# Altium schematic sheet Power Supply.SchDoc
size A3; SheetNumber: 3; SheetTotal: 3
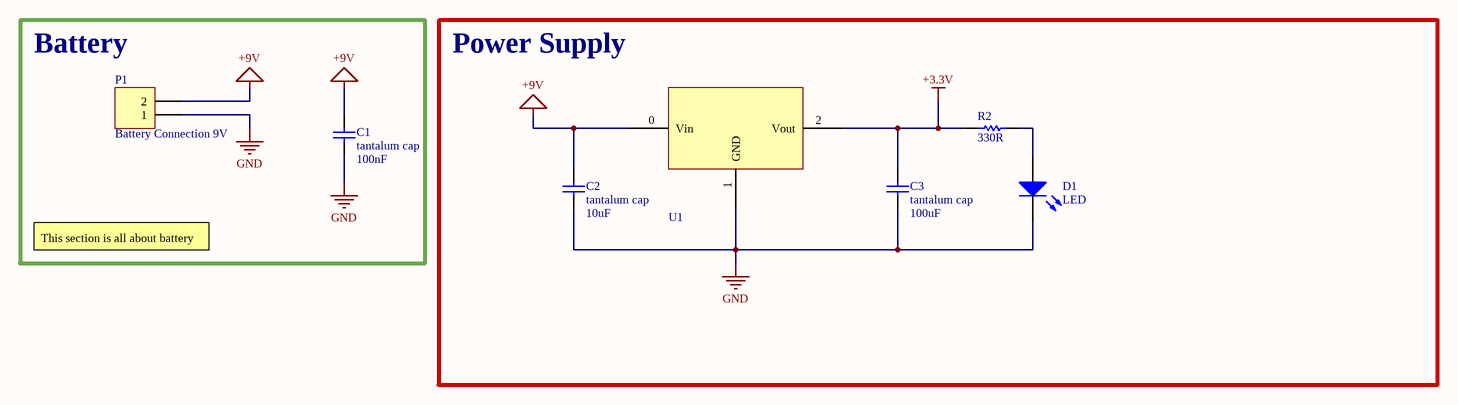
[diagram p0: Power Supply.SchDoc]

## Parts
C1  tantalum cap  value 100nF  [C1206tancap]
C2  tantalum cap  value 10uF  [C1206tancap]
C3  tantalum cap  value 100uF  [C1206tancap]
D1  LED  [MY_LED_0805]
P1  Battery Connection 9V  [HDR1X2H3dbody]
R2  330R  [MY_0805]
U1  LM1117  [LM1117]  (value not drawn)

## Blocks framed on the sheet
Battery: C1 P1
Power Supply: C2 C3 D1 R2 U1

## Nets
+3.3V: C3.2 R2.1 U1.2(Vout)
+9V: C1.2 C2.2 P1.2 U1.0(Vin)
GND: C1.1 C2.1 C3.1 D1.K P1.1 U1.1(GND)
NetD1_A: D1.A R2.2

## Notes on the sheet
- This section is all about battery

## Library data of the parts
C1-C3 = Cap Semi_6: Capacitor (Semiconductor SIM Model); Published: 8-Jun-2000; LatestRevisionDate: 29-May-2009; LatestRevisionNote: IPC-7351 Footprint Added.; PackageReference: C1206; Publisher: Altium Limited; PackageDescription: Chip Capacitor
D1 = LED: Typical INFRARED GaAs LED; ASiD Part Number: LED-AS
P1 = Header 2H: Header, 2-Pin, Right Angle; LatestRevisionDate: 17-Jul-2002; LatestRevisionNote: Re-released for DXP Platform.; Publisher: Altium Limited; Voltage: 9V
R2 = Res: Standard resistor; ASiD Part Number: Res-AS; Value: 330R
U1 = LM1117: The LM1117 is a low dropout voltage regulator with a / dropout of 1.2 V at 800 mA of load current. / The LM1117 is available in an adjustable version, / which can set the output voltage from 1.25 V to 13.8 V / with only two external resistors. In addition, the device / is available in five fixed voltages, 1.8 V, 2.5 V, 3.3 V, / and 5 V. / The LM1117 offers current limiting and thermal / shutdown. The circuit includes a Zener trimmed bandgap reference to assure output voltage accuracy to / within ±1%. / A minimum of 10-µF tantalum capacitor is required / at the output to improve the transient response and / stability.; ComponentLink1Description: datasheet; ComponentLink1URL: https://www.ti.com/lit/ds/symlink/lm1117.pdf?ts=1693661767040&ref_url=https%253A%252F%252Fwww.ti.com%252Fproduct%252FLM1117%253Futm_source%253Dgoogle%2526utm_medium%253Dcpc%2526utm_campaign%253Dapp-null-null-GPN_EN-cpc-pf-google-wwe%2526utm_content%253DLM1117%2526ds_k%253DLM1117%2BDatasheet%2526DCM%253Dyes%2526gclid%253DCj0KCQjwusunBhCYARIsAFBsUP-EfZQ_4w22SCOHjBNPWV0Us_SkAtT2YC_2xqzBz3rUpggmxNL9StEaAur4EALw_wcB%2526gclsrc%253Daw.ds